# Altium project AMC_FMC_Carrier.PrjPcb (part 2 of 7)

## Sheet FPGA_SDRAM.SchDoc
size A3; DocumentNumber: 18; SheetNumber: 18; SheetTotal: 30
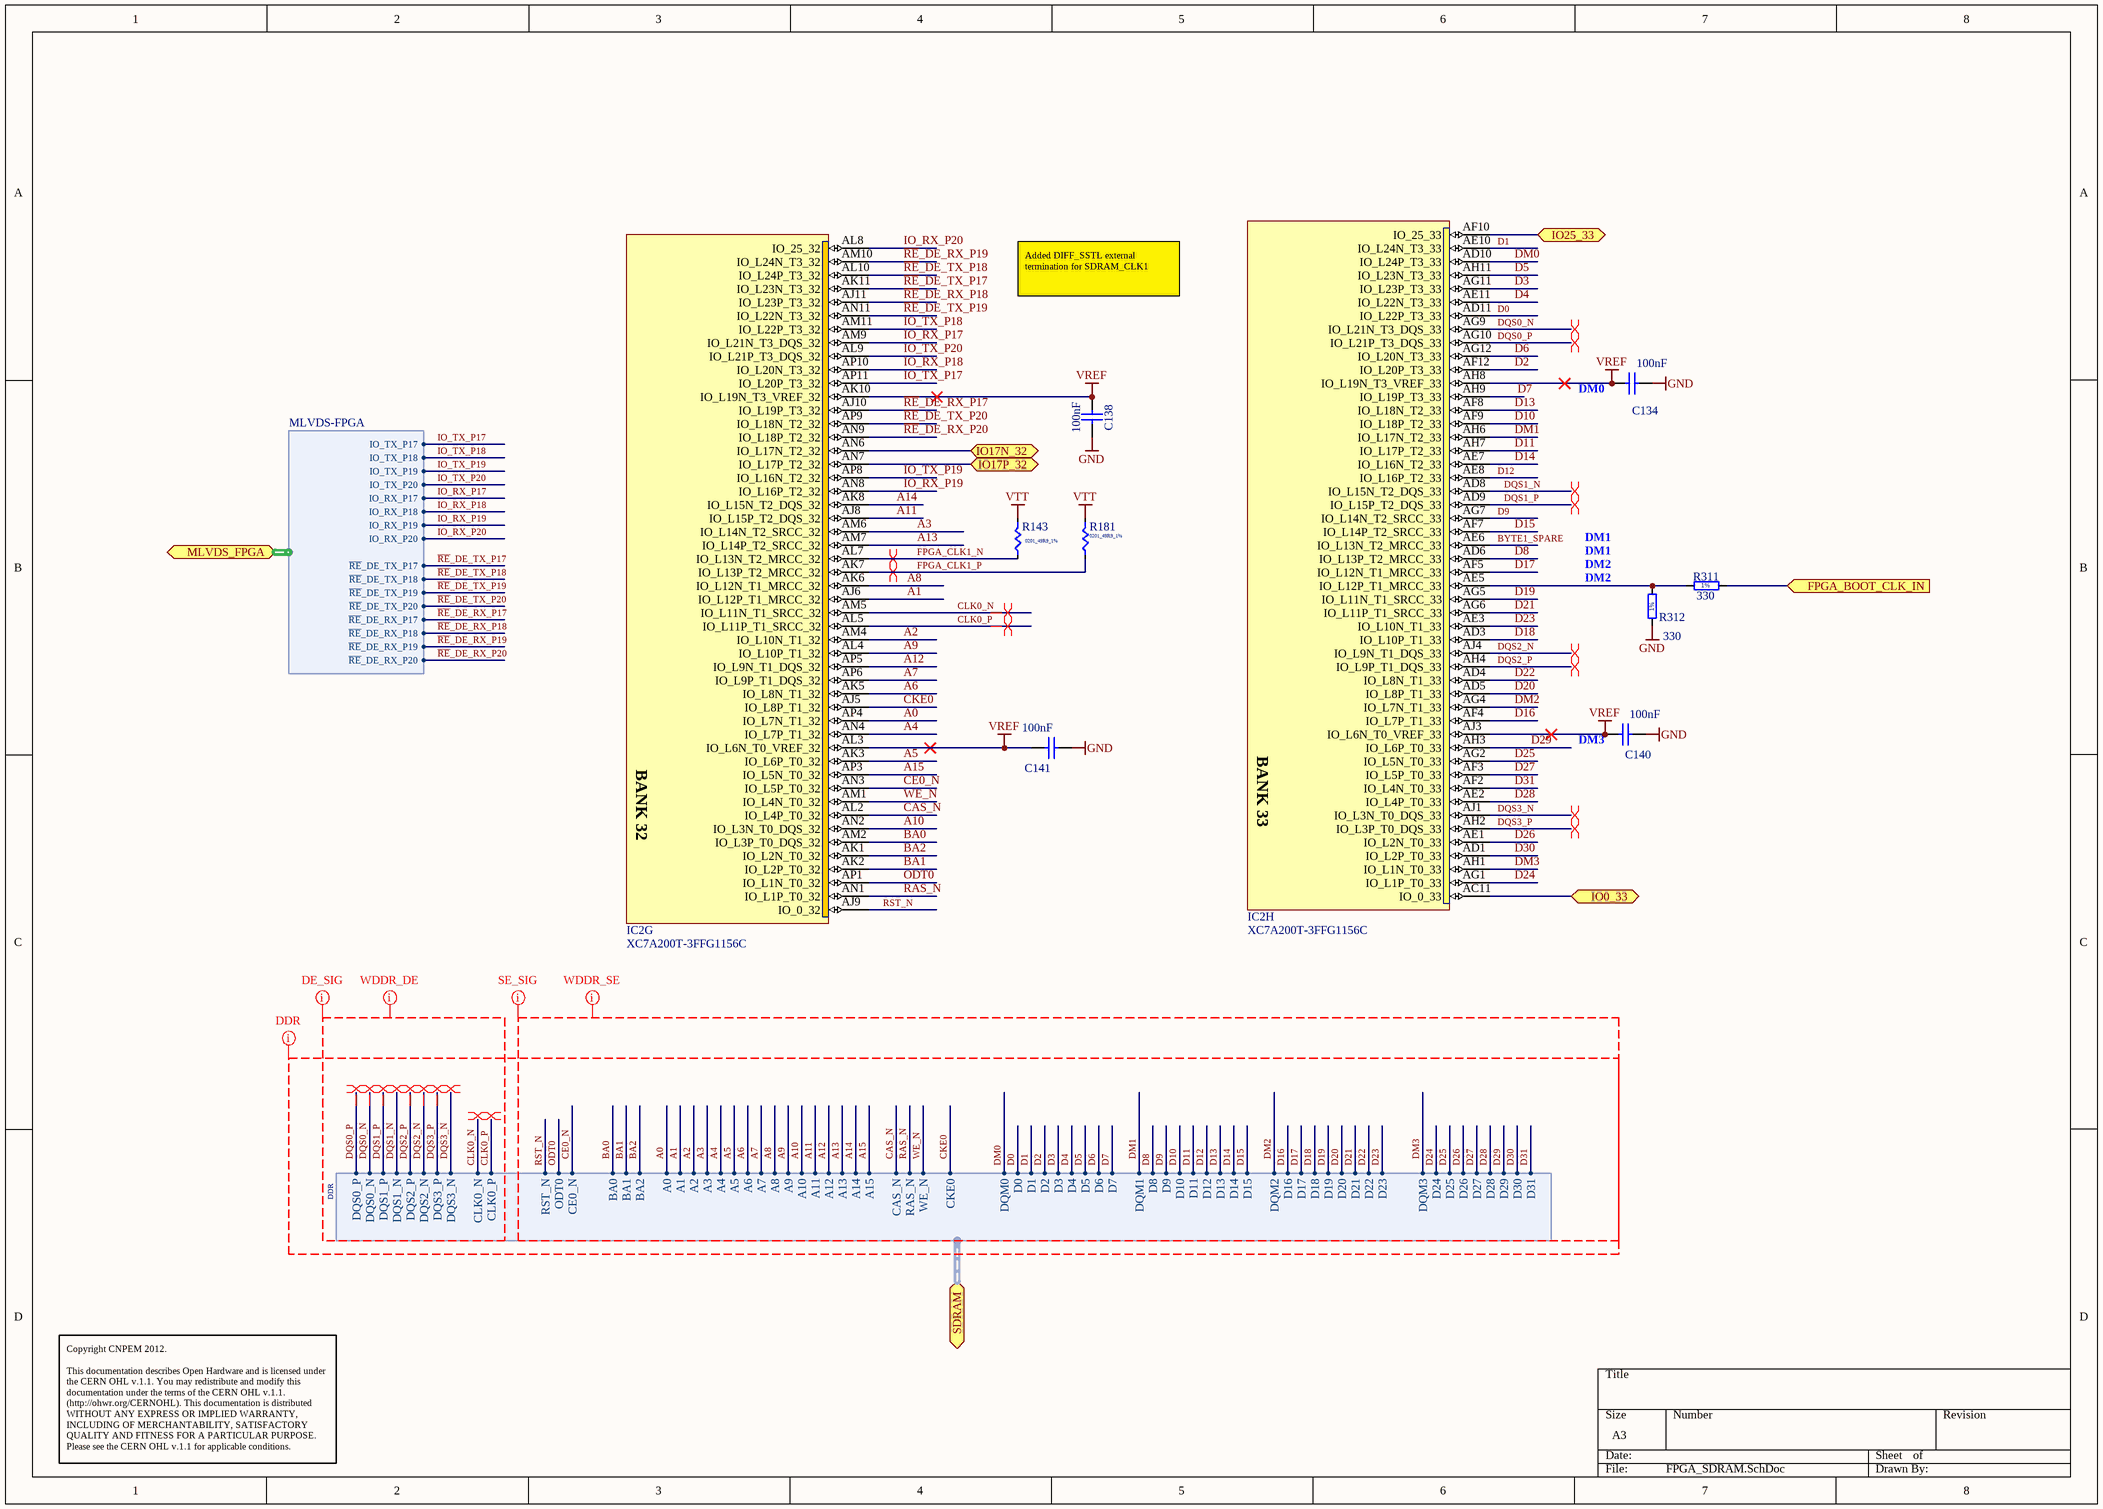
[diagram p3: FPGA_SDRAM.SchDoc]

### Parts
(Parts that share a designator on the sheet are numbered #1, #2 ... from top to bottom, then left to right.)
C134  100nF  [CAPC0603X33N]
C138  100nF  [CAPC0603X33N]
C140  100nF  [CAPC0603X33N]
C141  100nF  [CAPC0603X33N]
IC2#2  XC7A200T-3FFG1156C  [BGA1156C100P34X34_3500X3500X335]  (parts G,H of 23)
R143  0201_49R9_1%  [RESC0603X40N]
R181  0201_49R9_1%  [RESC0603X40N]
R311  330  [RESC1005X40N]
R312  330  [RESC1005X40N]

### Ports
FPGA_BOOT_CLK_IN (in), IO0_33 (bidir), IO17N_32 (bidir), IO17P_32 (bidir), IO25_33 (bidir), MLVDS_FPGA (harness MLVDS-FPGA), SDRAM (harness DDR)

### Harnesses
DDR: CKE0, A0, A1, A2, A3, A4, A5, A7, A8, A9, A10, A11, A12, A13, BA0, BA1, BA2, A14, A15, CAS_N, RAS_N, WE_N, CE0_N, A6, D0, D1, D2, D3, D4, D5, D6, D7, D8, D9, D10, D11, D12, D13, D14, D15, CLK0_N, CLK0_P, ODT0, RST_N, D16, D17, D18, D19, D20, D21, D22, D23, D24, D25, D26, D27, D28, D29, D30, D31, DQS0_P, DQS1_P, DQS0_N, DQS1_N, DQS3_N, DQS3_P, DQS2_P, DQS2_N, DQM0, DQM1, DQM2, DQM3
MLVDS-FPGA: IO_TX_P17, IO_TX_P18, IO_TX_P19, IO_TX_P20, IO_RX_P17, IO_RX_P18, IO_RX_P19, IO_RX_P20, ~{RE}_DE_TX_P17, ~{RE}_DE_TX_P18, ~{RE}_DE_TX_P19, ~{RE}_DE_TX_P20, ~{RE}_DE_RX_P17, ~{RE}_DE_RX_P18, ~{RE}_DE_RX_P19, ~{RE}_DE_RX_P20

### Nets
GND: C134.2 C138.2 C140.2 C141.2 R312.1
VREF: C134.1 C138.1 C140.1 C141.1 IC2#2.AH8(IO_L19N_T3_VREF_33) IC2#2.AJ3(IO_L6N_T0_VREF_33) IC2#2.AK10(IO_L19N_T3_VREF_32) IC2#2.AL3(IO_L6N_T0_VREF_32)
VTT: R143.1(+) R181.1(+)
A0: IC2#2.AP4(IO_L7N_T1_32) ; port SDRAM.A0  [project net FDDR.A0]
A1: IC2#2.AJ6(IO_L12P_T1_MRCC_32) ; port SDRAM.A1  [project net FDDR.A1]
A2: IC2#2.AM4(IO_L10N_T1_32) ; port SDRAM.A2  [project net FDDR.A2]
A3: IC2#2.AM6(IO_L14N_T2_SRCC_32) ; port SDRAM.A3  [project net FDDR.A3]
A4: IC2#2.AN4(IO_L7P_T1_32) ; port SDRAM.A4  [project net FDDR.A4]
A5: IC2#2.AK3(IO_L6P_T0_32) ; port SDRAM.A5  [project net FDDR.A5]
A6: IC2#2.AK5(IO_L8N_T1_32) ; port SDRAM.A6  [project net FDDR.A6]
A7: IC2#2.AP6(IO_L9P_T1_DQS_32) ; port SDRAM.A7  [project net FDDR.A7]
A8: IC2#2.AK6(IO_L12N_T1_MRCC_32) ; port SDRAM.A8  [project net FDDR.A8]
A9: IC2#2.AL4(IO_L10P_T1_32) ; port SDRAM.A9  [project net FDDR.A9]
A10: IC2#2.AN2(IO_L3N_T0_DQS_32) ; port SDRAM.A10  [project net FDDR.A10]
A11: IC2#2.AJ8(IO_L15P_T2_DQS_32) ; port SDRAM.A11  [project net FDDR.A11]
A12: IC2#2.AP5(IO_L9N_T1_DQS_32) ; port SDRAM.A12  [project net FDDR.A12]
A13: IC2#2.AM7(IO_L14P_T2_SRCC_32) ; port SDRAM.A13  [project net FDDR.A13]
A14: IC2#2.AK8(IO_L15N_T2_DQS_32) ; port SDRAM.A14  [project net FDDR.A14]
A15: IC2#2.AP3(IO_L5N_T0_32) ; port SDRAM.A15  [project net FDDR.A15]
BA0: IC2#2.AM2(IO_L3P_T0_DQS_32) ; port SDRAM.BA0  [project net FDDR.BA0]
BA1: IC2#2.AK2(IO_L2P_T0_32) ; port SDRAM.BA1  [project net FDDR.BA1]
BA2: IC2#2.AK1(IO_L2N_T0_32) ; port SDRAM.BA2  [project net FDDR.BA2]
BYTE1_SPARE: IC2#2.AE6(IO_L13N_T2_MRCC_33)
CAS_N: IC2#2.AL2(IO_L4P_T0_32) ; port SDRAM.CAS_N  [project net FDDR.CAS_N]
CE0_N: IC2#2.AN3(IO_L5P_T0_32) ; port SDRAM.CE0_N  [project net FDDR.CE0_N]
CKE0: IC2#2.AJ5(IO_L8P_T1_32) ; port SDRAM.CKE0  [project net FDDR.CKE0]
CLK0_N: IC2#2.AM5(IO_L11N_T1_SRCC_32) ; port SDRAM.CLK0_N  [project net FDDR.CLK0_N]
CLK0_P: IC2#2.AL5(IO_L11P_T1_SRCC_32) ; port SDRAM.CLK0_P  [project net FDDR.CLK0_P]
D0: IC2#2.AD11(IO_L22P_T3_33) ; port SDRAM.D0  [project net FDDR.D0]
D1: IC2#2.AE10(IO_L24N_T3_33) ; port SDRAM.D1  [project net FDDR.D1]
D2: IC2#2.AF12(IO_L20P_T3_33) ; port SDRAM.D2  [project net FDDR.D2]
D3: IC2#2.AG11(IO_L23P_T3_33) ; port SDRAM.D3  [project net FDDR.D3]
D4: IC2#2.AE11(IO_L22N_T3_33) ; port SDRAM.D4  [project net FDDR.D4]
D5: IC2#2.AH11(IO_L23N_T3_33) ; port SDRAM.D5  [project net FDDR.D5]
D6: IC2#2.AG12(IO_L20N_T3_33) ; port SDRAM.D6  [project net FDDR.D6]
D7: IC2#2.AH9(IO_L19P_T3_33) ; port SDRAM.D7  [project net FDDR.D7]
D8: IC2#2.AD6(IO_L13P_T2_MRCC_33) ; port SDRAM.D8  [project net FDDR.D8]
D9: IC2#2.AG7(IO_L14N_T2_SRCC_33) ; port SDRAM.D9  [project net FDDR.D9]
D10: IC2#2.AF9(IO_L18P_T2_33) ; port SDRAM.D10  [project net FDDR.D10]
D11: IC2#2.AH7(IO_L17P_T2_33) ; port SDRAM.D11  [project net FDDR.D11]
D12: IC2#2.AE8(IO_L16P_T2_33) ; port SDRAM.D12  [project net FDDR.D12]
D13: IC2#2.AF8(IO_L18N_T2_33) ; port SDRAM.D13  [project net FDDR.D13]
D14: IC2#2.AE7(IO_L16N_T2_33) ; port SDRAM.D14  [project net FDDR.D14]
D15: IC2#2.AF7(IO_L14P_T2_SRCC_33) ; port SDRAM.D15  [project net FDDR.D15]
D16: IC2#2.AF4(IO_L7P_T1_33) ; port SDRAM.D16  [project net FDDR.D16]
D17: IC2#2.AF5(IO_L12N_T1_MRCC_33) ; port SDRAM.D17  [project net FDDR.D17]
D18: IC2#2.AD3(IO_L10P_T1_33) ; port SDRAM.D18  [project net FDDR.D18]
D19: IC2#2.AG5(IO_L11N_T1_SRCC_33) ; port SDRAM.D19  [project net FDDR.D19]
D20: IC2#2.AD5(IO_L8P_T1_33) ; port SDRAM.D20  [project net FDDR.D20]
D21: IC2#2.AG6(IO_L11P_T1_SRCC_33) ; port SDRAM.D21  [project net FDDR.D21]
D22: IC2#2.AD4(IO_L8N_T1_33) ; port SDRAM.D22  [project net FDDR.D22]
D23: IC2#2.AE3(IO_L10N_T1_33) ; port SDRAM.D23  [project net FDDR.D23]
D24: IC2#2.AG1(IO_L1P_T0_33) ; port SDRAM.D24  [project net FDDR.D24]
D25: IC2#2.AG2(IO_L5N_T0_33) ; port SDRAM.D25  [project net FDDR.D25]
D26: IC2#2.AE1(IO_L2N_T0_33) ; port SDRAM.D26  [project net FDDR.D26]
D27: IC2#2.AF3(IO_L5P_T0_33) ; port SDRAM.D27  [project net FDDR.D27]
D28: IC2#2.AE2(IO_L4P_T0_33) ; port SDRAM.D28  [project net FDDR.D28]
D29: IC2#2.AH3(IO_L6P_T0_33) ; port SDRAM.D29  [project net FDDR.D29]
D30: IC2#2.AD1(IO_L2P_T0_33) ; port SDRAM.D30  [project net FDDR.D30]
D31: IC2#2.AF2(IO_L4N_T0_33) ; port SDRAM.D31  [project net FDDR.D31]
DM0: IC2#2.AD10(IO_L24P_T3_33) ; port SDRAM.DQM0  [project net FDDR.DQM0]
DM1: IC2#2.AH6(IO_L17N_T2_33) ; port SDRAM.DQM1  [project net FDDR.DQM1]
DM2: IC2#2.AG4(IO_L7N_T1_33) ; port SDRAM.DQM2  [project net FDDR.DQM2]
DM3: IC2#2.AH1(IO_L1N_T0_33) ; port SDRAM.DQM3  [project net FDDR.DQM3]
DQS0_N: IC2#2.AG9(IO_L21N_T3_DQS_33) ; port SDRAM.DQS0_N  [project net FDDR.DQS0_N]
DQS0_P: IC2#2.AG10(IO_L21P_T3_DQS_33) ; port SDRAM.DQS0_P  [project net FDDR.DQS0_P]
DQS1_N: IC2#2.AD8(IO_L15N_T2_DQS_33) ; port SDRAM.DQS1_N  [project net FDDR.DQS1_N]
DQS1_P: IC2#2.AD9(IO_L15P_T2_DQS_33) ; port SDRAM.DQS1_P  [project net FDDR.DQS1_P]
DQS2_N: IC2#2.AJ4(IO_L9N_T1_DQS_33) ; port SDRAM.DQS2_N  [project net FDDR.DQS2_N]
DQS2_P: IC2#2.AH4(IO_L9P_T1_DQS_33) ; port SDRAM.DQS2_P  [project net FDDR.DQS2_P]
DQS3_N: IC2#2.AJ1(IO_L3N_T0_DQS_33) ; port SDRAM.DQS3_N  [project net FDDR.DQS3_N]
DQS3_P: IC2#2.AH2(IO_L3P_T0_DQS_33) ; port SDRAM.DQS3_P  [project net FDDR.DQS3_P]
FPGA_BOOT_CLK_IN: R311.2 ; port FPGA_BOOT_CLK_IN
FPGA_CLK1_N: IC2#2.AL7(IO_L13N_T2_MRCC_32) R143.2(-)
FPGA_CLK1_P: IC2#2.AK7(IO_L13P_T2_MRCC_32) R181.2(-)
IO0_33: IC2#2.AC11(IO_0_33) ; port IO0_33
IO17N_32: IC2#2.AN6(IO_L17N_T2_32) ; port IO17N_32
IO17P_32: IC2#2.AN7(IO_L17P_T2_32) ; port IO17P_32
IO25_33: IC2#2.AF10(IO_25_33) ; port IO25_33
IO_RX_P17: IC2#2.AM9(IO_L21N_T3_DQS_32) ; port MLVDS_FPGA.IO_RX_P17  [project net MLVDS_F.IO_RX_P17]
IO_RX_P18: IC2#2.AP10(IO_L20N_T3_32) ; port MLVDS_FPGA.IO_RX_P18  [project net MLVDS_F.IO_RX_P18]
IO_RX_P19: IC2#2.AN8(IO_L16P_T2_32) ; port MLVDS_FPGA.IO_RX_P19  [project net MLVDS_F.IO_RX_P19]
IO_RX_P20: IC2#2.AL8(IO_25_32) ; port MLVDS_FPGA.IO_RX_P20  [project net MLVDS_F.IO_RX_P20]
IO_TX_P17: IC2#2.AP11(IO_L20P_T3_32) ; port MLVDS_FPGA.IO_TX_P17  [project net MLVDS_F.IO_TX_P17]
IO_TX_P18: IC2#2.AM11(IO_L22P_T3_32) ; port MLVDS_FPGA.IO_TX_P18  [project net MLVDS_F.IO_TX_P18]
IO_TX_P19: IC2#2.AP8(IO_L16N_T2_32) ; port MLVDS_FPGA.IO_TX_P19  [project net MLVDS_F.IO_TX_P19]
IO_TX_P20: IC2#2.AL9(IO_L21P_T3_DQS_32) ; port MLVDS_FPGA.IO_TX_P20  [project net MLVDS_F.IO_TX_P20]
ODT0: IC2#2.AP1(IO_L1N_T0_32) ; port SDRAM.ODT0  [project net FDDR.ODT0]
~{RE}_DE_RX_P17: IC2#2.AJ10(IO_L19P_T3_32) ; port MLVDS_FPGA.~{RE}_DE_RX_P17  [project net MLVDS_F.~{RE}_DE_RX_P17]
~{RE}_DE_RX_P18: IC2#2.AJ11(IO_L23P_T3_32) ; port MLVDS_FPGA.~{RE}_DE_RX_P18  [project net MLVDS_F.~{RE}_DE_RX_P18]
~{RE}_DE_RX_P19: IC2#2.AM10(IO_L24N_T3_32) ; port MLVDS_FPGA.~{RE}_DE_RX_P19  [project net MLVDS_F.~{RE}_DE_RX_P19]
~{RE}_DE_RX_P20: IC2#2.AN9(IO_L18P_T2_32) ; port MLVDS_FPGA.~{RE}_DE_RX_P20  [project net MLVDS_F.~{RE}_DE_RX_P20]
~{RE}_DE_TX_P17: IC2#2.AK11(IO_L23N_T3_32) ; port MLVDS_FPGA.~{RE}_DE_TX_P17  [project net MLVDS_F.~{RE}_DE_TX_P17]
~{RE}_DE_TX_P18: IC2#2.AL10(IO_L24P_T3_32) ; port MLVDS_FPGA.~{RE}_DE_TX_P18  [project net MLVDS_F.~{RE}_DE_TX_P18]
~{RE}_DE_TX_P19: IC2#2.AN11(IO_L22N_T3_32) ; port MLVDS_FPGA.~{RE}_DE_TX_P19  [project net MLVDS_F.~{RE}_DE_TX_P19]
~{RE}_DE_TX_P20: IC2#2.AP9(IO_L18N_T2_32) ; port MLVDS_FPGA.~{RE}_DE_TX_P20  [project net MLVDS_F.~{RE}_DE_TX_P20]
RAS_N: IC2#2.AN1(IO_L1P_T0_32) ; port SDRAM.RAS_N  [project net FDDR.RAS_N]
RST_N: IC2#2.AJ9(IO_0_32) ; port SDRAM.RST_N  [project net FDDR.RST_N]
WE_N: IC2#2.AM1(IO_L4N_T0_32) ; port SDRAM.WE_N  [project net FDDR.WE_N]
NetIC2#2_AE5: IC2#2.AE5(IO_L12P_T1_MRCC_33) R311.1 R312.2

### Layout directives
differential pair: FDDR.CLK0_N, FDDR.CLK0_P, FDDR.DQS0_N, FDDR.DQS0_P, FDDR.DQS1_N, FDDR.DQS1_P, FDDR.DQS2_N, FDDR.DQS2_P, FDDR.DQS3_N, FDDR.DQS3_P, FPGA_CLK1_N, FPGA_CLK1_P
net class DDR: A0, A1, A2, A3, A4, A5, A6, A7, A8, A9, A10, A11, A12, A13, A14, A15, BA0, BA1, BA2, CAS_N, CE0_N, CKE0, CLK0_N, CLK0_P, D0, D1, D2, D3, D4, D5, D6, D7, D8, D9, D10, D11, D12, D13, D14, D15, D16, D17, D18, D19, D20, D21, D22, D23, D24, D25, D26, D27, D28, D29, D30, D31, DM0, DM1, DM2, DM3, DQS0_N, DQS0_P, DQS1_N, DQS1_P, DQS2_N, DQS2_P, DQS3_N, DQS3_P, ODT0, RAS_N, RST_N, WE_N
net class DE_SIG: CLK0_N, CLK0_P, DQS0_N, DQS0_P, DQS1_N, DQS1_P, DQS2_N, DQS2_P, DQS3_N, DQS3_P
net class SE_SIG: A0, A1, A2, A3, A4, A5, A6, A7, A8, A9, A10, A11, A12, A13, A14, A15, BA0, BA1, BA2, CAS_N, CE0_N, CKE0, D0, D1, D2, D3, D4, D5, D6, D7, D8, D9, D10, D11, D12, D13, D14, D15, D16, D17, D18, D19, D20, D21, D22, D23, D24, D25, D26, D27, D28, D29, D30, D31, DM0, DM1, DM2, DM3, ODT0, RAS_N, RST_N, WE_N
net class WDDR_DE: CLK0_N, CLK0_P, DQS0_N, DQS0_P, DQS1_N, DQS1_P, DQS2_N, DQS2_P, DQS3_N, DQS3_P
net class WDDR_SE: A0, A1, A2, A3, A4, A5, A6, A7, A8, A9, A10, A11, A12, A13, A14, A15, BA0, BA1, BA2, CAS_N, CE0_N, CKE0, D0, D1, D2, D3, D4, D5, D6, D7, D8, D9, D10, D11, D12, D13, D14, D15, D16, D17, D18, D19, D20, D21, D22, D23, D24, D25, D26, D27, D28, D29, D30, D31, DM0, DM1, DM2, DM3, ODT0, RAS_N, RST_N, WE_N

### Notes on the sheet
- Added DIFF_SSTL external termination for SDRAM_CLK1
- (near C134) DM0
- DM1
- (near R312) DM2
- (near C140) DM3
- Copyright CNPEM 2012.
  This documentation describes Open Hardware and is licensed under the CERN OHL v.1.1. You may redistribute and modify this documentation under the terms of the CERN OHL v.1.1. (http://ohwr.org/CERNOHL). This documentation is distributed WITHOUT ANY EXPRESS OR IMPLIED WARRANTY, INCLUDING OF MERCHANTABILITY, SATISFACTORY QUALITY AND FITNESS FOR A PARTICULAR PURPOSE. Please see the CERN OHL v.1.1 for applicable conditions.
- (in symbol R0402_330R_1%_0.0625W_100PPM) 1%
- (in symbol XC7A200T-3FFG1156C, part G) BANK 32
- (in symbol XC7A200T-3FFG1156C, part H) BANK 33
- (in symbol XC7A350T-2FFG1156C, part G) BANK 32
- (in symbol XC7A350T-2FFG1156C, part H) BANK 33

### Library data of the parts
C134 C138 C140 C141 = CC0201_100NF_6.3V_10%_X5R: Non-polarised capacitor; Part Description: SMD Multilayer Chip Ceramic Capacitor; Manufacturer: GENERIC; Manufacturer1 Part Number: 02016D104KAT2A; Voltage: 6.3V; TC: X5R; Tolerance: ±10%; Table: Capacitors SMD; Part Number: CC0201_100NF_6.3V_10%_X5R; Component Kind: Standard; Component Type: Standard; Pin Count: 2; Value: 100nF; Status: Not Recommended; Manufacturer Part Number: CC0201_100NF_6.3V_10%_X5R; Case: 0201; Mounted: Yes; Socket: No; SMD: Yes; Manufacturer1 Example: AVX; Manufacturer1 ComponentHeight: 0.33mm; HelpURL: \\cern.ch\dfs\Applications\Altium\Datasheets\CC0201_X5R_AVX.pdf; Author: CERN DEM JLC; CreateDate: 2007-12-03; LatestRevisionDate: 2007-12-03
IC2#2 = XC7A200T-3FFG1156C: Artix-6 FPGA, 16 GTPs, 600 User I/Os, 1156-Pin BGA, Speed Grade 2, Commercial Grade, Pb-Free; Part Description: Artix-7 FPGA, 16 GTPs, 600 User I/Os, 1156-Pin BGA, Speed Grade 2, Commercial Grade, Pb-Free; Manufacturer: XILINX; Table: Logic; Part Number: XC7A200T-3FFG1156C; Component Kind: Standard; Component Type: Standard; Device: XC7A200T-3FFG1156C; PackageDescription: BGA, 1.00mm Pitch, Square; 1156 Pin, 34 Columns X 34 Rows, 35.00mm X 35.00mm X 3.350mm H; Manufacturer Part Number: XC7A200T-3FFG1156C; Pin Count: 1156; Case: BGA1156; Mounted: Yes; Socket: No; SMD: Yes; ComponentHeight: 3.35mm; HelpURL: \\cern.ch\dfs\Applications\Altium\Datasheets\XC7A350T-2FFG1156C.pdf; ComponentLink1URL: \\cern.ch\dfs\Applications\Altium\Datasheets\XC7A350T-2FFG1156C.pdf; ComponentLink1Description: Package/Pinout; Author: CERN DEM JLC; CreateDate: 2012-09-19; LatestRevisionDate: 2012-09-19
R143 R181 = SMT_0402_0201: MiscInfo: Biggest Cern Footprint [max height]; Document Name: FPGA_SDRAM.SchDoc; Part Number: SMT_0402_0201; FootprintSizeX (mm): 1.8; FootprintSizeY (mm): 0.9; FootprintRectangleArea (mm): 1.62; Thickness (Max) (mm): 0.4; FootprintAlias: 0402
R311 R312 = R0402_330R_1%_0.0625W_100PPM: Resistor - 1%; Part Description: General Purpose Thick Film Chip Resistor; Manufacturer: GENERIC; Manufacturer1 Part Number: 232270673301L; TC: ±100ppm/°C; Table: Resistors SMD; Part Number: R0402_330R_1%_0.0625W_100PPM; Component Kind: Standard; Component Type: Standard; Pin Count: 2; Value: 330; Status: Not recommended; Power: 0.0625W; Tolerance: ±1%; Manufacturer Part Number: R0402_330R_1%_0.0625W_100PPM; Case: 0402; Mounted: Yes; Socket: No; SMD: Yes; Manufacturer1 Example: YAGEO PHYCOMP; Manufacturer1 ComponentHeight: 0.4mm; HelpURL: \\cern.ch\dfs\Applications\Altium\Datasheets\R0402_Phycomp_RC0402.pdf; Author: CERN DEM JLC; CreateDate: 2007-12-03; LatestRevisionDate: 2012-10-17

## Sheet Power_Management.SchDoc
size A4; DocumentNumber: 9; SheetNumber: 9; SheetTotal: 30
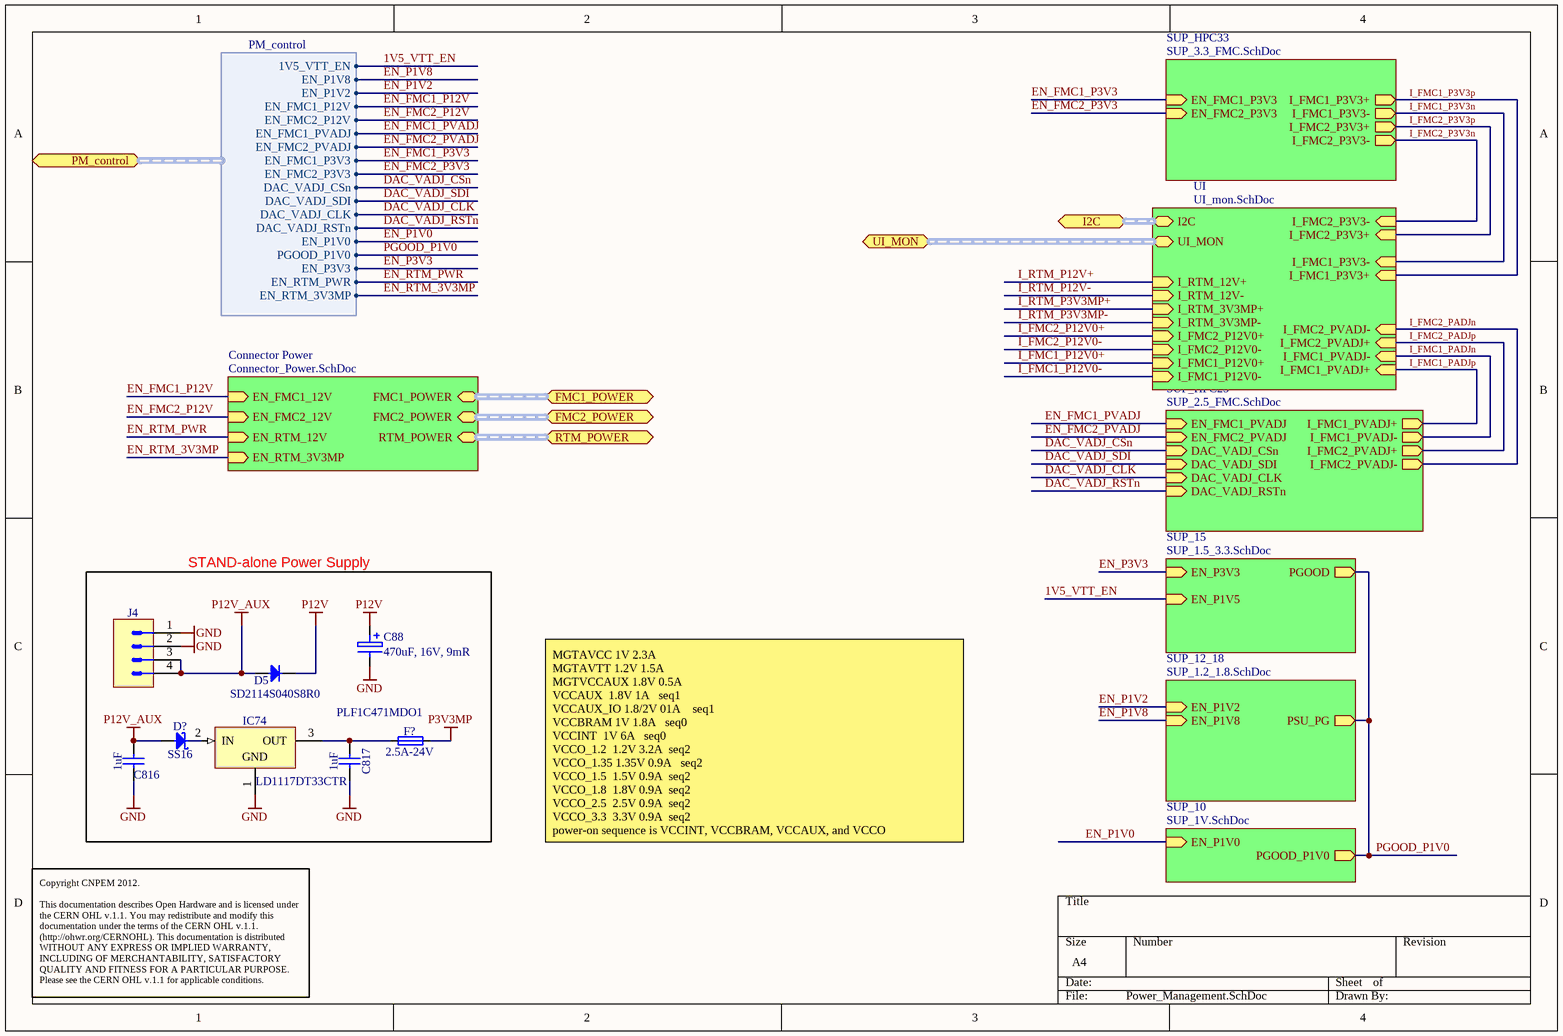
[diagram p4: Power_Management.SchDoc]

### Parts
(Parts that share a designator on the sheet are numbered #1, #2 ... from top to bottom, then left to right.)
C88  PLF1C471MDO1  value 470uF, 16V, 9mR  [CAPPR500-1000X1250]
C816  1uF  [CAPC1608X87N]
C817  1uF  [CAPC1608X87N]
D5  SD2114S040S8R0  [AVX_SMB (D0-214AA)]
D?#4  SS16  [DIOM5127X229N]
F?#1  2.5A-24V  [FUSC1608X55N]
IC74  LD1117DT33CTR  [TO228P972X240-3N-R540X510]
J4  Mini-Fit Jr.™  [MOLEX_39-28-1043]  (value not drawn)

### Blocks framed on the sheet
STAND-alone Power Supply: C88 C816 C817 D5 D?#4 F?#1 IC74 J4

### Sub-sheets
Connector Power = Connector_Power.SchDoc: FMC2_POWER (harness FMC_J1_POWER), EN_FMC1_12V (in), FMC1_POWER (harness FMC_J1_POWER), EN_FMC2_12V (in), EN_RTM_12V (in), RTM_POWER (harness RTM_POWER), EN_RTM_3V3MP (in)
SUP_10 = SUP_1V.SchDoc: PGOOD_P1V0 (out), EN_P1V0 (in)
SUP_12_18 = SUP_1.2_1.8.SchDoc (file not in this document): EN_P1V2 (in), EN_P1V8 (in), PSU_PG (out)
SUP_15 = SUP_1.5_3.3.SchDoc: PGOOD (out), EN_P1V5 (in), EN_P3V3 (in)
SUP_HPC25 = SUP_2.5_FMC.SchDoc: EN_FMC1_PVADJ (in), EN_FMC2_PVADJ (in), I_FMC1_PVADJ+ (out), I_FMC1_PVADJ- (out), I_FMC2_PVADJ+ (out), I_FMC2_PVADJ- (out), DAC_VADJ_CSn (in), DAC_VADJ_SDI (in), DAC_VADJ_CLK (in), DAC_VADJ_RSTn (in)
SUP_HPC33 = SUP_3.3_FMC.SchDoc: EN_FMC1_P3V3 (in), EN_FMC2_P3V3 (in), I_FMC1_P3V3+ (out), I_FMC1_P3V3- (out), I_FMC2_P3V3+ (out), I_FMC2_P3V3- (out)
UI = UI_mon.SchDoc: I_FMC2_P3V3- (in), I_FMC2_P3V3+ (in), I_FMC1_P3V3- (in), I_FMC1_P3V3+ (in), I_FMC1_PVADJ+ (in), I_FMC1_PVADJ- (in), I_FMC2_PVADJ+ (in), I_FMC2_PVADJ- (in), I_FMC2_P12V0+ (in), I_FMC2_P12V0- (in), I_FMC1_P12V0+ (in), I_FMC1_P12V0- (in), I2C (harness I2C), I_RTM_12V+ (in), I_RTM_12V- (in), I_RTM_3V3MP+ (in), I_RTM_3V3MP- (in), UI_MON (harness UI_MON)

### Ports
FMC1_POWER, FMC2_POWER, I2C (harness I2C), PM_control (harness PM_control), RTM_POWER, UI_MON

### Harnesses
PM_control: EN_P1V8, EN_P1V2, EN_FMC1_P12V, EN_FMC2_P12V, EN_FMC1_PVADJ, EN_FMC2_PVADJ, EN_FMC1_P3V3, EN_FMC2_P3V3, DAC_VADJ_CSn, DAC_VADJ_SDI, DAC_VADJ_CLK, DAC_VADJ_RSTn, 1V5_VTT_EN, EN_P1V0, PGOOD_P1V0, EN_P3V3, EN_RTM_PWR, EN_RTM_3V3MP

### Nets
GND: C88.2 C816.2 C817.2 IC74.1(GND) J4.1 J4.2
P3V3MP: F?#1.1
P12V: C88.1 D5.1(C)
P12V_AUX: C816.1 D5.2(A) D?#4.2(A) J4.3 J4.4
1V5_VTT_EN: sheet SUP_15/EN_P1V5, port PM_control.1V5_VTT_EN  [project net PM.1V5_VTT_EN]
DAC_VADJ_CLK: sheet SUP_HPC25/DAC_VADJ_CLK, port PM_control.DAC_VADJ_CLK  [project net PM.DAC_VADJ_CLK]
DAC_VADJ_CSn: sheet SUP_HPC25/DAC_VADJ_CSn, port PM_control.DAC_VADJ_CSn  [project net PM.DAC_VADJ_CSn]
DAC_VADJ_RSTn: sheet SUP_HPC25/DAC_VADJ_RSTn, port PM_control.DAC_VADJ_RSTn  [project net PM.DAC_VADJ_RSTn]
DAC_VADJ_SDI: sheet SUP_HPC25/DAC_VADJ_SDI, port PM_control.DAC_VADJ_SDI  [project net PM.DAC_VADJ_SDI]
EN_FMC1_P3V3: sheet SUP_HPC33/EN_FMC1_P3V3, port PM_control.EN_FMC1_P3V3  [project net PM.EN_FMC1_P3V3]
EN_FMC1_P12V: sheet Connector Power/EN_FMC1_12V, port PM_control.EN_FMC1_P12V  [project net PM.EN_FMC1_P12V]
EN_FMC1_PVADJ: sheet SUP_HPC25/EN_FMC1_PVADJ, port PM_control.EN_FMC1_PVADJ  [project net PM.EN_FMC1_PVADJ]
EN_FMC2_P3V3: sheet SUP_HPC33/EN_FMC2_P3V3, port PM_control.EN_FMC2_P3V3  [project net PM.EN_FMC2_P3V3]
EN_FMC2_P12V: sheet Connector Power/EN_FMC2_12V, port PM_control.EN_FMC2_P12V  [project net PM.EN_FMC2_P12V]
EN_FMC2_PVADJ: sheet SUP_HPC25/EN_FMC2_PVADJ, port PM_control.EN_FMC2_PVADJ  [project net PM.EN_FMC2_PVADJ]
EN_P1V0: sheet SUP_10/EN_P1V0, port PM_control.EN_P1V0  [project net PM.EN_P1V0]
EN_P1V2: sheet SUP_12_18/EN_P1V2, port PM_control.EN_P1V2  [project net PM.EN_P1V2]
EN_P1V8: sheet SUP_12_18/EN_P1V8, port PM_control.EN_P1V8  [project net PM.EN_P1V8]
EN_P3V3: sheet SUP_15/EN_P3V3, port PM_control.EN_P3V3  [project net PM.EN_P3V3]
EN_RTM_3V3MP: sheet Connector Power/EN_RTM_3V3MP, port PM_control.EN_RTM_3V3MP  [project net PM.EN_RTM_3V3MP]
EN_RTM_PWR: sheet Connector Power/EN_RTM_12V, port PM_control.EN_RTM_PWR  [project net PM.EN_RTM_PWR]
I_FMC1_P3V3n: sheet SUP_HPC33/I_FMC1_P3V3-, sheet UI/I_FMC1_P3V3-
I_FMC1_P3V3p: sheet SUP_HPC33/I_FMC1_P3V3+, sheet UI/I_FMC1_P3V3+
I_FMC1_PADJn: sheet SUP_HPC25/I_FMC1_PVADJ-, sheet UI/I_FMC1_PVADJ-
I_FMC1_PADJp: sheet SUP_HPC25/I_FMC1_PVADJ+, sheet UI/I_FMC1_PVADJ+
I_FMC2_P3V3n: sheet SUP_HPC33/I_FMC2_P3V3-, sheet UI/I_FMC2_P3V3-
I_FMC2_P3V3p: sheet SUP_HPC33/I_FMC2_P3V3+, sheet UI/I_FMC2_P3V3+
I_FMC2_PADJn: sheet SUP_HPC25/I_FMC2_PVADJ-, sheet UI/I_FMC2_PVADJ-
I_FMC2_PADJp: sheet SUP_HPC25/I_FMC2_PVADJ+, sheet UI/I_FMC2_PVADJ+
PGOOD_P1V0: sheet SUP_15/PGOOD, sheet SUP_12_18/PSU_PG, sheet SUP_10/PGOOD_P1V0, port PM_control.PGOOD_P1V0  [project net PM.PGOOD_P1V0]
NetC817_1: C817.1 F?#1.2 IC74.3(OUT)
NetD?#4_1: D?#4.1(C) IC74.2(IN)

### Buses and harness runs
harness port FMC1_POWER = sheet Connector Power/FMC1_POWER
harness port FMC2_POWER = sheet Connector Power/FMC2_POWER
harness port I2C = sheet UI/I2C
harness port RTM_POWER = sheet Connector Power/RTM_POWER
harness port UI_MON = sheet UI/UI_MON

### Notes on the sheet
- MGTAVCC	1V	2.3A
  MGTAVTT	1.2V	1.5A
  MGTVCCAUX	1.8V	0.5A
  VCCAUX		1.8V	1A			seq1
  VCCAUX_IO	1.8/2V	01A 			seq1
  VCCBRAM	1V	1.8A			seq0
  VCCINT		1V	6A			seq0
  VCCO_1.2		1.2V	3.2A		seq2
  VCCO_1.35	1.35V	0.9A			seq2
  VCCO_1.5		1.5V	0.9A		seq2
  VCCO_1.8		1.8V	0.9A		seq2
  VCCO_2.5		2.5V	0.9A		seq2
  VCCO_3.3		3.3V	0.9A		seq2
  power-on sequence is VCCINT, VCCBRAM, VCCAUX, and VCCO
  voltage difference between VCCO and VCCAUX must not exceed 2.625V for longer than TVCCO2VCCAUX
  power-on sequence to achieve minimum current draw for the GTP transceivers is VCCINT, VMGTAVCC,
  VMGTAVTT OR VMGTAVCC, VCCINT, VMGTAVTT. There is no recommended sequencing for VMGTVCCAUX. Both VMGTAVCC and
  VCCINT can be ramped simultaneously. The recommended power-off sequence is the reverse of the power-on sequence to
  achieve minimum current draw.
  When VMGTAVTT is powered before VMGTAVCC and VMGTAVTT – VMGTAVCC > 150 mV and VMGTAVCC < 0.7V, the
  VMGTAVTT current draw can increase by 460 mA per transceiver during VMGTAVCC ramp up. The duration of the current
  draw can be up to 0.3 x TMGTAVCC (ramp time from GND to 90% of VMGTAVCC). The reverse is true for power-down.
  • When VMGTAVTT is powered before VCCINT and VMGTAVTT – VCCINT > 150 mV and VCCINT < 0.7V, the VMGTAVTT current
  draw can increase by 50 mA per transceiver during VCCINT ramp up. The duration of the current draw can be up to
  0.3 x TVCCINT (ramp time from GND to 90% of VCCINT). The reverse is true for power-down.
- Copyright CNPEM 2012.
  This documentation describes Open Hardware and is licensed under the CERN OHL v.1.1. You may redistribute and modify this documentation under the terms of the CERN OHL v.1.1. (http://ohwr.org/CERNOHL). This documentation is distributed WITHOUT ANY EXPRESS OR IMPLIED WARRANTY, INCLUDING OF MERCHANTABILITY, SATISFACTORY QUALITY AND FITNESS FOR A PARTICULAR PURPOSE. Please see the CERN OHL v.1.1 for applicable conditions.

### Library data of the parts
C88 = CAP_POLYMER_10mm: POLY, 470uF, 16V, ESR: 9mR
C816 C817 = CC0603_1UF_16V_10%_X7R: Non-polarised capacitor; Part Description: SMD Multilayer Chip Ceramic Capacitor; Manufacturer: GENERIC; Manufacturer1 Part Number: 223824613663; Voltage: 16V; TC: X7R; Tolerance: ±10%; Table: Capacitors SMD; Part Number: CC0603_1UF_16V_10%_X7R; Component Kind: Standard; Component Type: Standard; Pin Count: 2; Value: 1uF; Status: Preferred; Manufacturer Part Number: CC0603_1uF_16V_10%_X7R; Case: 0603; Mounted: Yes; Socket: No; SMD: Yes; Manufacturer1 Example: PHYCOMP; Manufacturer1 ComponentHeight: 0.87mm; HelpURL: \\cern.ch\dfs\Applications\Altium\Datasheets\CC0805_X5R_PHYCOMP_HC.pdf; Author: CERN DEM JLC; CreateDate: 2007-12-03; LatestRevisionDate: 2007-12-03
D5 = SD2114S040S8R0: Diode; Part Description: Schottky Barrier Rectifier Diode; Manufacturer: AVX; Voltage: 40V; Power: 8A; PressFit: No; Bonding: No; Part Number: SD2114S040S8R0; Component Kind: Standard; Component Type: Standard; Device: SD2114S040S8R0; PackageDescription: AVX SMB DO-214-AA Lead-less Chip Form, 2-Leads, Body 5.2x3.6mm; Manufacturer Part Number: SD2114S040S8R0; Pin Count: 2; Case: D0-214AA; Mounted: Yes; Socket: No; SMD: Yes; Sense: No; ComponentHeight: 1.2mm; HelpURL: \\cern.ch\dfs\Applications\Altium\Datasheets\SD2114S040S8R0.pdf; Author: CERN DEM JLC; CreateDate: 20/10/2016; LatestRevisionDate: 20/10/2016
D?#4 = SS16: Schottky Diode; Part Description: Surface Mount Schottky Barrier Rectifier; Manufacturer: VISHAY GENERAL SEMICONDUCTOR; Voltage: 60V; Power: 1A; Table: Diodes; Part Number: SS16; Component Kind: Standard; Component Type: Standard; Device: SS16; PackageDescription: DO-214-AC Molded Diode, Body 5.1x2.7mm, IPC Medium Density; Manufacturer Part Number: SS16; Pin Count: 2; Case: DO-214AC; Mounted: Yes; Socket: No; SMD: Yes; ComponentHeight: 2.29mm; HelpURL: \\cern.ch\dfs\Applications\Altium\Datasheets\SS16.pdf; Author: CERN DEM JLC; CreateDate: 2008-07-15; LatestRevisionDate: 2010-08-23
F?#1 = FUS0603_BOURNS-SF-0603F250-2: Fuse; Part Description: Thin Film Chip Fuse; Manufacturer: BOURNS; PressFit: No; Part Number: FUS0603_BOURNS-SF-0603F250-2; Component Kind: Standard; Component Type: Standard; Pin Count: 2; PackageDescription: Chip Fuse, 2-Leads, Body 1.6mm x 0.8mm, IPC Medium Density; Family: Fuse; Mounted: Yes; Socket: No; SMD: Yes; Sense: No; Value: 2.5A-24V; Manufacturer Part Number: SF-0603F250-2; ComponentHeight: 0.55mm; HelpURL: \\cern.ch\dfs\Applications\Altium\Datasheets\FUSE_BOURNS_SF-0603F.pdf; Author: CERN DEM JLC; CreateDate: 31/03/2010; LatestRevisionDate: 31/03/2010
IC74 = LD1117DT33CTR: 3-Terminal Regulator 1=GND 2=IN 3=OUT; Part Description: 3.3V 800mA Low drop fixed and adjustable positive voltage regulators; Manufacturer: ST MICROELECTRONICS; Table: Regulators; Part Number: LD1117DT33CTR; Component Kind: Standard; Component Type: Standard; Device: LD1117DT33CTR; PackageDescription: DPAK TO-252, 2.28mm pitch; 2 pin, 9.725mm L X 6.10mm W X 2.40mm H body, IPC Medium Density; Manufacturer Part Number: LD1117DT33CTR; Pin Count: 3; Case: DPAK; Mounted: Yes; Socket: No; SMD: Yes; ComponentHeight: 2.4mm; HelpURL: \\cern.ch\dfs\Applications\Altium\Datasheets\LD1117DT33CTR.pdf; Author: CERN DEM JLC; CreateDate: 2011-06-08; LatestRevisionDate: 2011-06-08
J4 = MOLEX_39-28-1043: Connector 4 Male; Part Description: 4.20mm (.165") Pitch Mini-Fit Jr.™ Header, Dual Row, Vertical, without Snap-in Plastic Peg PCB Lock, 4 Circuits; Manufacturer: MOLEX; Part Number: MOLEX_39-28-1043; Component Kind: Standard; Component Type: Standard; Pin Count: 4; Family: Mini-Fit Jr.™; Mounted: Yes; Socket: No; SMD: No; Status: None; Manufacturer Part Number: 39-28-1043; ComponentHeight: 13.1mm; HelpURL: \\cern.ch\dfs\Applications\Altium\Datasheets\MOLEX_39-28-1043.pdf; Author: CERN DEM JLC; CreateDate: 2009-03-12; LatestRevisionDate: 2012-03-06; Table: MOLEX

## Sheet SUP_2.5_FMC.SchDoc
size A4; DocumentNumber: 26; SheetNumber: 26; SheetTotal: 30
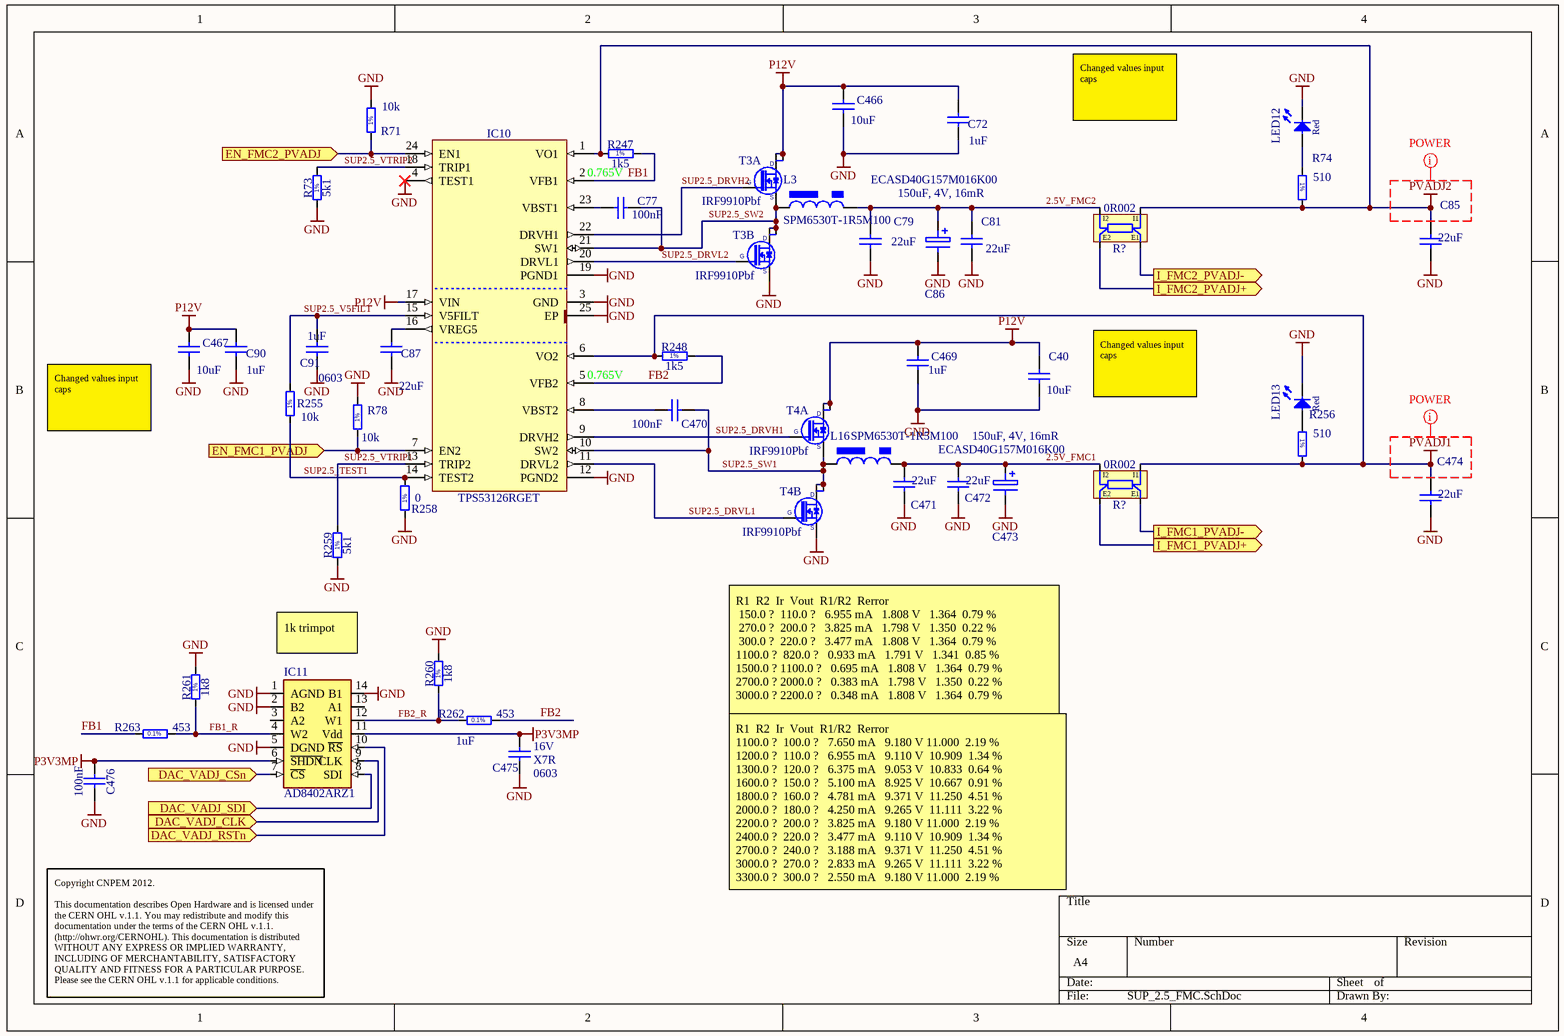
[diagram p5: SUP_2.5_FMC.SchDoc]

### Parts
(Parts that share a designator on the sheet are numbered #1, #2 ... from top to bottom, then left to right.)
C40  10uF  [CAPC2012X135N]
C72  1uF  [CAPC1608X87N]
C77  100nF  [CAPC1005X55N]
C79  22uF  [CAPC3216X180N]
C81  22uF  [CAPC3216X180N]
C85  22uF  [CAPC3216X180N]
C86  ECASD40G157M016K00  value 150uF, 4V, 16mR  [2917_POLY]
C87  22uF  [CAPC3216X180N]
C90  1uF  [CAPC1608X87N]
C91  1uF  Case: 0603  [CAPC1608X87N]
C466  10uF  [CAPC2012X135N]
C467  10uF  [CAPC2012X135N]
C469  1uF  [CAPC1608X87N]
C470  100nF  [CAPC1005X55N]
C471  22uF  [CAPC3216X180N]
C472  22uF  [CAPC3216X180N]
C473  ECASD40G157M016K00  value 150uF, 4V, 16mR  [2917_POLY]
C474  22uF  [CAPC3216X180N]
C475  1uF  Voltage: 16V  TC: X7R  Case: 0603  [CAPC1608X87N]
C476  100nF  [CAPC0603X33N]
IC10  TPS53126RGET  [QFN50P400X400X100-25N-S255]
IC11  AD8402ARZ1  [SO-14]
L3  SPM6530T-1R5M100  [IND_TDK_SPM6530]
L16  SPM6530T-1R5M100  [IND_TDK_SPM6530]
LED12  Red  [LED_AVAGO_HSMC-C150]  (value not drawn)
LED13  Red  [LED_AVAGO_HSMC-C150]  (value not drawn)
R71  10k  [RESC1005X40N]
R73  5k1  [RESC1608X55N]
R74  510  [RESC1005X40N]
R78  10k  [RESC1005X40N]
R247  1k5  [RESC1608X55N]
R248  1k5  [RESC1608X55N]
R255  10k  [RESC1005X40N]
R256  510  [RESC1005X40N]
R258  0  [RESC1005X40N]
R259  5k1  [RESC1608X55N]
R260  1k8  [RESC1608X55N]
R261  1k8  [RESC1608X55N]
R262  453  [RESC1608X55N]
R263  453  [RESC1608X55N]
R?#1  0R002  [RES_VISHAY_WSL3637_0R002-0R01]
R?#2  0R002  [RES_VISHAY_WSL3637_0R002-0R01]
T3  IRF9910Pbf  [SOIC127P600X175-8N]  (parts A,B of 2)
T4  IRF9910Pbf  [SOIC127P600X175-8N]  (parts A,B of 2)

### Ports
DAC_VADJ_CLK (in), DAC_VADJ_CSn (in), DAC_VADJ_RSTn (in), DAC_VADJ_SDI (in), EN_FMC1_PVADJ (in), EN_FMC2_PVADJ (in), I_FMC1_PVADJ+ (out), I_FMC1_PVADJ- (out), I_FMC2_PVADJ+ (out), I_FMC2_PVADJ- (out)

### Nets
GND: C40.1 C72.1 C79.2 C81.2 C85.2 C86.2 C87.1 C90.1 C91.1 C466.1 C467.1 C469.1 C471.2 C472.2 C473.2 C474.2 C475.1 C476.2 IC10.3(GND) IC10.4(TEST1) IC10.12(PGND2) IC10.19(PGND1) IC10.25(EP) IC11.1(AGND) IC11.2(B2) IC11.5(DGND) IC11.14(B1) LED12.1(C) LED13.1(C) R71.2 R73.1 R78.2 R258.1 R259.1 R260.2 R261.2 T3.1(S) T4.1(S)
P3V3MP: C475.2 C476.1 IC11.6(~{SHDN}) IC11.11(Vdd)
P12V: C40.2 C72.2 C90.2 C466.2 C467.2 C469.2 IC10.17(VIN) T3.5(D) T3.6(D) T4.5(D) T4.6(D)
PVADJ1: C474.1 IC10.6(VO2) R248.1 R256.2 R?#2.I1
PVADJ2: C85.1 IC10.1(VO1) R74.2 R247.1 R?#1.I1
2.5V_FMC1: C471.1 C472.1 C473.1 L16.2 R?#2.I2
2.5V_FMC2: C79.1 C81.1 C86.1 L3.2 R?#1.I2
FB1: IC10.2(VFB1) R247.2 R263.1
FB1_R: IC11.4(W2) R261.1 R263.2
FB2: IC10.5(VFB2) R248.2 R262.2
FB2_R: IC11.12(W1) R260.1 R262.1
I_FMC1_PADJn: R?#2.E1 ; port I_FMC1_PVADJ-
I_FMC1_PADJp: R?#2.E2 ; port I_FMC1_PVADJ+
I_FMC2_PADJn: R?#1.E1 ; port I_FMC2_PVADJ-
I_FMC2_PADJp: R?#1.E2 ; port I_FMC2_PVADJ+
PM.DAC_VADJ_CLK: IC11.9(CLK) ; port DAC_VADJ_CLK
PM.DAC_VADJ_CSn: IC11.7(~{CS}) ; port DAC_VADJ_CSn
PM.DAC_VADJ_RSTn: IC11.10(~{RS}) ; port DAC_VADJ_RSTn
PM.DAC_VADJ_SDI: IC11.8(SDI) ; port DAC_VADJ_SDI
PM.EN_FMC1_PVADJ: IC10.7(EN2) R78.1 ; port EN_FMC1_PVADJ
PM.EN_FMC2_PVADJ: IC10.24(EN1) R71.1 ; port EN_FMC2_PVADJ
SUP2.5_DRVH1: IC10.9(DRVH2) T4.4(G)
SUP2.5_DRVH2: IC10.22(DRVH1) T3.4(G)
SUP2.5_DRVL1: IC10.11(DRVL2) T4.2(G)
SUP2.5_DRVL2: IC10.20(DRVL1) T3.2(G)
SUP2.5_SW1: C470.1 IC10.10(SW2) L16.1 T4.3(S) T4.7(D) T4.8(D)
SUP2.5_SW2: C77.1 IC10.21(SW1) L3.1 T3.3(S) T3.7(D) T3.8(D)
SUP2.5_TEST1: IC10.14(TEST2) R255.1 R258.2
SUP2.5_V5FILT: C91.2 IC10.15(V5FILT) R255.2
SUP2.5_VTRIP1: IC10.13(TRIP2) R259.2
SUP2.5_VTRIP2: IC10.18(TRIP1) R73.2
NetC77_2: C77.2 IC10.23(VBST1)
NetC87_2: C87.2 IC10.16(VREG5)
NetC470_2: C470.2 IC10.8(VBST2)
NetLED12_2: LED12.2(A) R74.1
NetLED13_2: LED13.2(A) R256.1

Not connected (* = marked no-connect by the designer): IC11 3(A2) 13(A1)

### Layout directives
net class POWER: PVADJ1, PVADJ2

### Notes on the sheet
- Changed values input caps
- 0.765V
- (near IC10) 0.765V
- (near C467) Changed values input caps
- 1k trimpot
- R1 	R2 	Ir 	Vout 	R1/R2 	Rerror
  150.0 ?	 110.0 ?	  6.955 mA	  1.808 V	  1.364	 0.79 %
  270.0 ?	 200.0 ?	  3.825 mA	  1.798 V	  1.350	 0.22 %
  300.0 ?	 220.0 ?	  3.477 mA	  1.808 V	  1.364	 0.79 %
  1100.0 ?	 820.0 ?	  0.933 mA	  1.791 V	  1.341	 0.85 %
  1500.0 ?	1100.0 ?	  0.695 mA	  1.808 V	  1.364	 0.79 %
  2700.0 ?	2000.0 ?	  0.383 mA	  1.798 V	  1.350	 0.22 %
  3000.0 ?	2200.0 ?	  0.348 mA	  1.808 V	  1.364	 0.79 %
- R1 	R2 	Ir 	Vout 	R1/R2 	Rerror
  1100.0 ?	 100.0 ?	  7.650 mA	  9.180 V	11.000	 2.19 %
  1200.0 ?	 110.0 ?	  6.955 mA	  9.110 V	 10.909	 1.34 %
  1300.0 ?	 120.0 ?	  6.375 mA	  9.053 V	 10.833	 0.64 %
  1600.0 ?	 150.0 ?	  5.100 mA	  8.925 V	 10.667	 0.91 %
  1800.0 ?	 160.0 ?	  4.781 mA	  9.371 V	 11.250	 4.51 %
  2000.0 ?	 180.0 ?	  4.250 mA	  9.265 V	 11.111	 3.22 %
  2200.0 ?	 200.0 ?	  3.825 mA	  9.180 V	11.000	 2.19 %
  2400.0 ?	 220.0 ?	  3.477 mA	  9.110 V	 10.909	 1.34 %
  2700.0 ?	 240.0 ?	  3.188 mA	  9.371 V	 11.250	 4.51 %
  3000.0 ?	 270.0 ?	  2.833 mA	  9.265 V	 11.111	 3.22 %
  3300.0 ?	 300.0 ?	  2.550 mA	  9.180 V	11.000	 2.19 %
- Copyright CNPEM 2012.
  This documentation describes Open Hardware and is licensed under the CERN OHL v.1.1. You may redistribute and modify this documentation under the terms of the CERN OHL v.1.1. (http://ohwr.org/CERNOHL). This documentation is distributed WITHOUT ANY EXPRESS OR IMPLIED WARRANTY, INCLUDING OF MERCHANTABILITY, SATISFACTORY QUALITY AND FITNESS FOR A PARTICULAR PURPOSE. Please see the CERN OHL v.1.1 for applicable conditions.
- (in symbol R0402_0R_JUMPER) 1%
- (in symbol R0402_10K_1%_0.0625W_100PPM) 1%
- (in symbol R0402_510R_1%_0.0625W_100PPM) 1%
- (in symbol R0603_1K5_1%_0.1W_100PPM) 1%
- (in symbol R0603_5K1_1%_0.1W_100PPM) 1%
- (in symbol R0603_453R_0.1%_0.063W_10PPM) 0.1%
- (in symbol R0603_910R_1%_0.1W_100PPM) 1%

### Library data of the parts
C40 C466 C467 = CC0805_10UF_16V_10%_X5R: Non-polarised capacitor; Part Description: SMD Multilayer Chip Ceramic Capacitor; Manufacturer: GENERIC; Manufacturer1 Part Number: C0805C106K4PAC; Voltage: 16V; TC: X5R; Tolerance: ±10%; Table: Capacitors SMD; Part Number: CC0805_10UF_16V_10%_X5R; Component Kind: Standard; Component Type: Standard; Pin Count: 2; Value: 10uF; Status: Preferred; Manufacturer Part Number: CC0805_10UF_16V_10%_X5R; Case: 0805; Mounted: Yes; Socket: No; SMD: Yes; Manufacturer1 Example: KEMET; Manufacturer1 ComponentHeight: 1.4mm; HelpURL: \\cern.ch\dfs\Applications\Altium\Datasheets\CC1206_X5R_KEMET.pdf; Author: CERN DEM JLC; CreateDate: 2007-12-03; LatestRevisionDate: 2007-12-03
C72 C90 C91 C469 = CC0603_1UF_16V_10%_X7R: as C816 on sheet Power_Management; Part Number: CC0603_1UF_16V_10%_X7R; Component Kind: Standard; Component Type: Standard; Pin Count: 2; Value: 1uF; Status: Preferred; Manufacturer Part Number: CC0603_1uF_16V_10%_X7R; Mounted: Yes; Socket: No; SMD: Yes; Manufacturer1 Example: PHYCOMP; Manufacturer1 ComponentHeight: 0.87mm; HelpURL: \\cern.ch\dfs\Applications\Altium\Datasheets\CC0805_X5R_PHYCOMP_HC.pdf; Author: CERN DEM JLC
  C72 C90 C469: Case: 0603; CreateDate: 2007-12-03; LatestRevisionDate: 2007-12-03
  C91: CreateDate: 03/12/2007; LatestRevisionDate: 03/12/2007
C77 C470 = CC0402_100NF_16V_10%_X7R: Non-polarised capacitor; Part Description: SMD Multilayer Chip Ceramic Capacitor; Manufacturer: GENERIC; Manufacturer1 Part Number: 223878715649; Voltage: 16V; TC: X7R; Tolerance: ±10%; Table: Capacitors SMD; Part Number: CC0402_100NF_16V_10%_X7R; Component Kind: Standard; Component Type: Standard; Pin Count: 2; Value: 100nF; Status: Not Recommended; Manufacturer Part Number: CC0402_100NF_16V_10%_X7R; Case: 0402; Mounted: Yes; Socket: No; SMD: Yes; Manufacturer1 Example: PHYCOMP; Manufacturer1 ComponentHeight: 0.55mm; HelpURL: \\cern.ch\dfs\Applications\Altium\Datasheets\CC0402_X7R_PHYCOMP.pdf; Author: CERN DEM JLC; CreateDate: 2007-12-03; LatestRevisionDate: 2007-12-03
C79 C81 C85 C87 C471 C472 C474 = CC1206_22UF_10V_10%_X7R: Non-polarised capacitor; Part Description: SMD Multilayer Chip Ceramic Capacitor; Manufacturer: GENERIC; Manufacturer1 Part Number: GRM31CR71A226KE15L; Voltage: 10V; TC: X7R; Tolerance: ±10%; Table: Capacitors SMD; Part Number: CC1206_22UF_10V_10%_X7R; Component Kind: Standard; Component Type: Standard; Pin Count: 2; Value: 22uF; Status: Preferred; Manufacturer Part Number: CC1206_22UF_10V_10%_X7R; Case: 1206; Mounted: Yes; Socket: No; SMD: Yes; Manufacturer1 Example: MURATA; Manufacturer1 ComponentHeight: 1.8mm; HelpURL: \\cern.ch\dfs\Applications\Altium\Datasheets\CC1206_X7R_MURATA_GRM-HI-CAP.pdf; Author: CERN DEM JLC; CreateDate: 2010-06-08; LatestRevisionDate: 2010-06-08
C86 C473 = CAP_POLYMER_SMDD: POLY, 150uF, 4V, ESR: 16mR
C475 = CC0603_1UF_16V_10%_X7R: Non-polarised capacitor; Part Description: SMD Multilayer Chip Ceramic Capacitor; Manufacturer: GENERIC; Manufacturer1 Part Number: 223824613663; Tolerance: ±10%; Table: Capacitors SMD; Part Number: CC0603_1UF_16V_10%_X7R; Component Kind: Standard; Component Type: Standard; Pin Count: 2; Value: 1uF; Status: Preferred; Manufacturer Part Number: CC0603_1uF_16V_10%_X7R; Mounted: Yes; Socket: No; SMD: Yes; Manufacturer1 Example: PHYCOMP; Manufacturer1 ComponentHeight: 0.87mm; HelpURL: \\cern.ch\dfs\Applications\Altium\Datasheets\CC0805_X5R_PHYCOMP_HC.pdf; Author: CERN DEM JLC; CreateDate: 12/3/2007; LatestRevisionDate: 12/3/2007
C476 = CC0201_100NF_6.3V_10%_X5R: as C134 on sheet FPGA_SDRAM; Part Number: CC0201_100NF_6.3V_10%_X5R; Component Kind: Standard; Component Type: Standard; Pin Count: 2; Value: 100nF; Status: Not Recommended; Manufacturer Part Number: CC0201_100NF_6.3V_10%_X5R; Case: 0201; Mounted: Yes; Socket: No; SMD: Yes; Manufacturer1 Example: AVX; Manufacturer1 ComponentHeight: 0.33mm; HelpURL: \\cern.ch\dfs\Applications\Altium\Datasheets\CC0201_X5R_AVX.pdf; Author: CERN DEM JLC; CreateDate: 2007-12-03; LatestRevisionDate: 2007-12-03
IC10 = TPS53126RGET: Dual Synchronous Step-Down Controller For Low Voltage Power Rails; Manufacturer: TEXAS INSTRUMENTS; Table: Analog & Interface; Part Number: TPS53126RGET; Component Kind: Standard; Component Type: Standard; Device: TPS53126RGET; PackageDescription: QFN,0.50mm pitch,square;6 pin X 6 pin,4.15mm X 4.15mm X 1.00mm H body (w/thermal tab 2.55 X 2.55mm),  IPC Medium Density; Part Description: Dual Synchronous Step-Down Controller For Low Voltage Power Rails; Manufacturer Part Number: TPS53126RGET; Pin Count: 25; Case: QFN24; Mounted: Yes; Socket: No; SMD: Yes; ComponentHeight: 1.0mm; Author: CERN DEM JLC; HelpURL: \\cern.ch\dfs\Applications\Altium\Datasheets\TPS53126RGET.pdf; CreateDate: 2010-08-26; LatestRevisionDate: 2010-08-26
IC11 = DAC_AD8402: 1k dual digital potentiometer; Supplier 1: Digi-Key; Supplier Part Number 1: AD8402ARZ100-ND
L3 L16 = L_POWER_SPM6530T: 1.5uH, 20%, 10mR, 11.5A; Supplier 1: Arrow; Supplier Part Number 1: 51419938S48550N1165
LED12 LED13 = LED_AVAGO_HSMC-C150: LED Red 1C 2A; Part Description: Surface Mount Red LED (1206 Case); Manufacturer: AVAGO TECHNOLOGIES; PressFit: No; Bonding: No; Part Number: LED_AVAGO_HSMC-C150; Component Kind: Standard; Component Type: Standard; Color: Red; PackageDescription: Red Chip LED, 2-Leads, Body 3.2 x1.6mm, IPC Medium Density; Manufacturer Part Number: HSMC-C150; Pin Count: 2; Case: 1206; Mounted: Yes; Socket: No; SMD: Yes; Sense: No; ComponentHeight: 1.2mm; HelpURL: \\cern.ch\dfs\Applications\Altium\Datasheets\LED_AVAGO_HSMC-C150.pdf; Author: CERN DEM JLC; CreateDate: 18/06/2013; LatestRevisionDate: 18/06/2013
R71 R78 R255 = R0402_10K_1%_0.0625W_100PPM: Resistor - 1%; Part Description: General Purpose Thick Film Chip Resistor; Manufacturer: GENERIC; Manufacturer1 Part Number: 232270671003L; TC: ±100ppm/°C; Table: Resistors SMD; Part Number: R0402_10K_1%_0.0625W_100PPM; Component Kind: Standard; Component Type: Standard; Pin Count: 2; Value: 10k; Status: Not recommended; Power: 0.0625W; Tolerance: ±1%; Manufacturer Part Number: R0402_10K_1%_0.0625W_100PPM; Case: 0402; Mounted: Yes; Socket: No; SMD: Yes; Manufacturer1 Example: YAGEO PHYCOMP; Manufacturer1 ComponentHeight: 0.4mm; HelpURL: \\cern.ch\dfs\Applications\Altium\Datasheets\R0402_Phycomp_RC0402.pdf; Author: CERN DEM JLC; CreateDate: 2007-12-03; LatestRevisionDate: 2012-10-17
R73 R259 = R0603_5K1_1%_0.1W_100PPM: Resistor - 1%; Part Description: General Purpose Thick Film Chip Resistor; Manufacturer: GENERIC; Manufacturer1 Part Number: NRC06F5101TRF; Power: 0.1W; TC: ±100ppm/°C; Table: Resistors SMD; Part Number: R0603_5K1_1%_0.1W_100PPM; Component Kind: Standard; Component Type: Standard; Pin Count: 2; Value: 5k1; Status: Preferred; Tolerance: ±1%; Manufacturer Part Number: R0603_5K1_1%_0.1W_100PPM; Case: 0603; Mounted: Yes; Socket: No; SMD: Yes; Manufacturer1 Example: NIC COMPONENT; Manufacturer1 ComponentHeight: 0.55mm; HelpURL: \\cern.ch\dfs\Applications\Altium\Datasheets\R0603_NIC_NRC.pdf; Author: CERN DEM JLC; CreateDate: 2007-12-03; LatestRevisionDate: 2008-03-13
R74 R256 = R0402_510R_1%_0.0625W_100PPM: Resistor - 1%; Part Description: General Purpose Thick Film Chip Resistor; Manufacturer: GENERIC; Manufacturer1 Part Number: 232270675101L; TC: ±100ppm/°C; Table: Resistors SMD; Part Number: R0402_510R_1%_0.0625W_100PPM; Component Kind: Standard; Component Type: Standard; Pin Count: 2; Value: 510; Status: Not recommended; Power: 0.0625W; Tolerance: ±1%; Manufacturer Part Number: R0402_510R_1%_0.0625W_100PPM; Case: 0402; Mounted: Yes; Socket: No; SMD: Yes; Manufacturer1 Example: YAGEO PHYCOMP; Manufacturer1 ComponentHeight: 0.4mm; HelpURL: \\cern.ch\dfs\Applications\Altium\Datasheets\R0402_Phycomp_RC0402.pdf; Author: CERN DEM JLC; CreateDate: 2007-12-03; LatestRevisionDate: 2012-10-17
R247 R248 = R0603_1K5_1%_0.1W_100PPM: Resistor - 1%; Part Description: General Purpose Thick Film Chip Resistor; Manufacturer: GENERIC; Manufacturer1 Part Number: NRC06F1501TRF; Power: 0.1W; TC: ±100ppm/°C; Table: Resistors SMD; Part Number: R0603_1K5_1%_0.1W_100PPM; Component Kind: Standard; Component Type: Standard; Pin Count: 2; Value: 1k5; Status: Preferred; Tolerance: ±1%; Manufacturer Part Number: R0603_1K5_1%_0.1W_100PPM; Case: 0603; Mounted: Yes; Socket: No; SMD: Yes; Manufacturer1 Example: NIC COMPONENT; Manufacturer1 ComponentHeight: 0.55mm; HelpURL: \\cern.ch\dfs\Applications\Altium\Datasheets\R0603_NIC_NRC.pdf; Author: CERN DEM JLC; CreateDate: 2007-12-03; LatestRevisionDate: 2008-03-13
R258 = R0402_0R_JUMPER: Resistor - 1%; Part Description: 1A (0.05R Max DC Resistance) Zero Ohm Jumper; Manufacturer: GENERIC; Manufacturer1 Part Number: 232270591001L; Table: Resistors SMD; Part Number: R0402_0R_JUMPER; Component Kind: Standard; Component Type: Standard; Pin Count: 2; Value: 0; Status: Not recommended; Manufacturer Part Number: R0402_0R_JUMPER; Case: 0402; Mounted: Yes; Socket: No; SMD: Yes; Manufacturer1 Example: YAGEO PHYCOMP; Manufacturer1 ComponentHeight: 0.4mm; HelpURL: \\cern.ch\dfs\Applications\Altium\Datasheets\R0402_Phycomp_RC0402.pdf; Author: CERN DEM JLC; CreateDate: 2007-12-03; LatestRevisionDate: 2012-10-17
R260 R261 = R0603_910R_1%_0.1W_100PPM: Resistor - 1%; Part Description: General Purpose Thick Film Chip Resistor; Manufacturer: GENERIC; Manufacturer1 Part Number: NRC06F9100TRF; Value: 910; Power: 0.1W; TC: ±100ppm/°C; Table: Resistors SMD; Part Number: R0603_910R_1%_0.1W_100PPM; Component Kind: Standard; Component Type: Standard; Pin Count: 2; Status: Preferred; Tolerance: ±1%; Manufacturer Part Number: R0603_910R_1%_0.1W_100PPM; Case: 0603; Mounted: Yes; Socket: No; SMD: Yes; Manufacturer1 Example: NIC COMPONENT; Manufacturer1 ComponentHeight: 0.55mm; HelpURL: \\cern.ch\dfs\Applications\Altium\Datasheets\R0603_NIC_NRC.pdf; Author: CERN DEM JLC; CreateDate: 2007-12-03; LatestRevisionDate: 2008-03-13
R262 R263 = R0603_453R_0.1%_0.063W_10PPM: Resistor - 0.1%; Part Description: Thin Film Chip Resistor; Manufacturer: GENERIC; Manufacturer1 Part Number: RN73C1J453RBTDF; Power: 0.063W; TC: ±10ppm; Table: Resistors SMD; Part Number: R0603_453R_0.1%_0.063W_10PPM; Component Kind: Standard; Component Type: Standard; Pin Count: 2; Value: 453; Status: Not recommended; Tolerance: ±0.1%; Manufacturer Part Number: R0603_453R_0.1%_0.063W_10PPM; Case: 0603; Mounted: Yes; Socket: No; SMD: Yes; Manufacturer1 Example: TYCO HOLSWORTHY; Manufacturer1 ComponentHeight: 0.5mm; HelpURL: \\cern.ch\dfs\Applications\Altium\Datasheets\R0603_Tyco_RN73.pdf; Author: CERN DEM JLC; CreateDate: 2007-12-03; LatestRevisionDate: 2008-03-13
R?#1 R?#2 = R3637_0R002_1%_3W_50PPM_VISHAY_WSL3637: Power and Current Sensing Resistor; Part Description: Power Metal Strip® Resistor, Low Value; Manufacturer: VISHAY DALE; Manufacturer Part Number: WSL36372L000FEA; Power: 3W; TC: ±75ppm/°C; Tolerance: ±1%; Part Number: R3637_0R002_1%_3W_50PPM_VISHAY_WSL3637; Component Kind: Standard; Component Type: Standard; Pin Count: 2; Value: 0R002; Status: None; Case: 3637; Mounted: Yes; Sense: No; Socket: No; SMD: Yes; ComponentHeight: 0.89mm; HelpURL: \\cern.ch\dfs\Applications\Altium\Datasheets\R3637_VISHAY_WSL3637.pdf; Author: CERN DEM MR; CreateDate: 02/06/2016; LatestRevisionDate: 02/06/2016
T3 T4 = IRF9910Pbf: Dual SO-8 MOSFET For POL Cconverter; Part Description: 20V 10A(Q1) 20V 12A (Q2) Dual SO-8 MOSFET For POL Cconverter; Manufacturer: INTERNATIONAL RECTIFIER; Table: Transistors; Part Number: IRF9910Pbf; Component Kind: Standard; Component Type: Standard; Device: IRF9910Pbf; PackageDescription: SOIC 8, Pitch 1.27mm - Body 4x5mm, IPC Medium Density; Manufacturer Part Number: IRF9910Pbf; Pin Count: 8; Case: DO8; Mounted: Yes; Socket: No; SMD: Yes; ComponentHeight: 1.75mm; HelpURL: \\cern.ch\dfs\Applications\Altium\Datasheets\IRF9910Pbf.pdf; Author: CERN DEM JLC; CreateDate: 2010-08-30; LatestRevisionDate: 2010-08-30